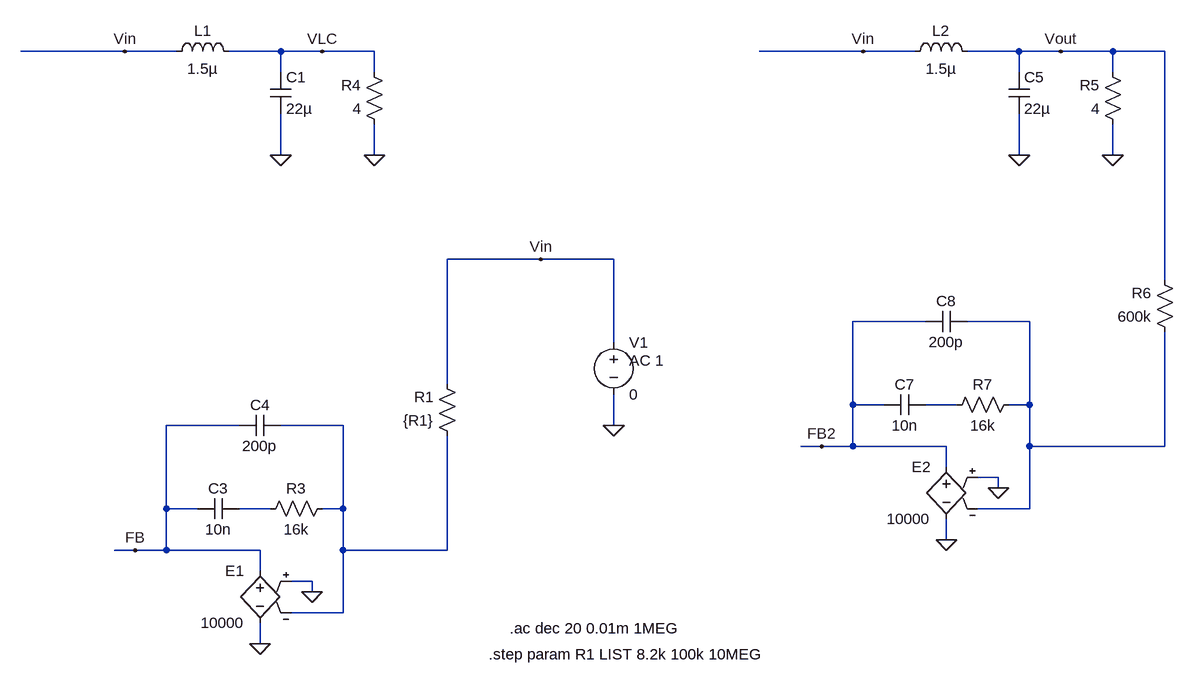
[diagram p0: schematic ErrorAmp2.asc]
ErrorAmp2.asc, the LTspice schematic file:
Version 4
SHEET 1 1920 680
WIRE -128 -512 -288 -512
WIRE -48 -512 -128 -512
WIRE 112 -512 32 -512
WIRE 176 -512 112 -512
WIRE 256 -512 176 -512
WIRE 1008 -512 848 -512
WIRE 1088 -512 1008 -512
WIRE 1248 -512 1168 -512
WIRE 1312 -512 1248 -512
WIRE 1392 -512 1312 -512
WIRE 1472 -512 1392 -512
WIRE 112 -480 112 -512
WIRE 256 -480 256 -512
WIRE 1248 -480 1248 -512
WIRE 1392 -480 1392 -512
WIRE 112 -352 112 -416
WIRE 256 -352 256 -400
WIRE 1248 -352 1248 -416
WIRE 1392 -352 1392 -400
WIRE 512 -192 368 -192
WIRE 624 -192 512 -192
WIRE 1472 -160 1472 -512
WIRE 1104 -96 992 -96
WIRE 1264 -96 1168 -96
WIRE 624 -64 624 -192
WIRE 368 0 368 -192
WIRE 992 32 992 -96
WIRE 1040 32 992 32
WIRE 1152 32 1104 32
WIRE 1264 32 1264 -96
WIRE 1264 32 1232 32
WIRE 48 64 -64 64
WIRE 208 64 112 64
WIRE 624 64 624 16
WIRE 944 96 912 96
WIRE 992 96 992 32
WIRE 992 96 944 96
WIRE 1136 96 992 96
WIRE 1264 96 1264 32
WIRE 1472 96 1472 -80
WIRE 1472 96 1264 96
WIRE 1136 128 1136 96
WIRE 1216 144 1184 144
WIRE 1216 160 1216 144
WIRE -64 192 -64 64
WIRE -16 192 -64 192
WIRE 96 192 48 192
WIRE 208 192 208 64
WIRE 208 192 176 192
WIRE 1264 192 1264 96
WIRE 1264 192 1184 192
WIRE 1136 240 1136 208
WIRE -112 256 -144 256
WIRE -64 256 -64 192
WIRE -64 256 -112 256
WIRE 80 256 -64 256
WIRE 208 256 208 192
WIRE 368 256 368 80
WIRE 368 256 208 256
WIRE 80 288 80 256
WIRE 160 304 128 304
WIRE 160 320 160 304
WIRE 208 352 208 256
WIRE 208 352 128 352
WIRE 80 400 80 368
FLAG 80 400 0
FLAG 160 320 0
FLAG 624 64 0
FLAG -112 256 FB
FLAG 112 -352 0
FLAG 256 -352 0
FLAG 512 -192 Vin
FLAG -128 -512 Vin
FLAG 176 -512 VLC
FLAG 1248 -352 0
FLAG 1392 -352 0
FLAG 1008 -512 Vin
FLAG 1312 -512 Vout
FLAG 1136 240 0
FLAG 1216 160 0
FLAG 944 96 FB2
SYMBOL voltage 624 -80 R0
WINDOW 123 24 44 Left 2
WINDOW 39 0 0 Left 2
SYMATTR InstName V1
SYMATTR Value 0
SYMATTR Value2 AC 1
SYMBOL e 80 272 M0
SYMATTR InstName E1
SYMATTR Value 10000
SYMBOL res 384 96 R180
WINDOW 0 36 76 Left 2
WINDOW 3 36 40 Left 2
SYMATTR InstName R1
SYMATTR Value {R1}
SYMBOL res 80 208 R270
WINDOW 0 32 56 VTop 2
WINDOW 3 0 56 VBottom 2
SYMATTR InstName R3
SYMATTR Value 16k
SYMBOL cap 48 176 R90
WINDOW 0 0 32 VBottom 2
WINDOW 3 32 32 VTop 2
SYMATTR InstName C3
SYMATTR Value 10n
SYMBOL cap 112 48 R90
WINDOW 0 0 32 VBottom 2
WINDOW 3 32 32 VTop 2
SYMATTR InstName C4
SYMATTR Value 200p
SYMBOL ind -64 -496 R270
WINDOW 0 32 56 VTop 2
WINDOW 3 5 56 VBottom 2
SYMATTR InstName L1
SYMATTR Value 1.5µ
SYMBOL cap 96 -480 R0
SYMATTR InstName C1
SYMATTR Value 22µ
SYMBOL res 272 -384 R180
WINDOW 0 36 76 Left 2
WINDOW 3 36 40 Left 2
SYMATTR InstName R4
SYMATTR Value 4
SYMBOL ind 1072 -496 R270
WINDOW 0 32 56 VTop 2
WINDOW 3 5 56 VBottom 2
SYMATTR InstName L2
SYMATTR Value 1.5µ
SYMBOL cap 1232 -480 R0
SYMATTR InstName C5
SYMATTR Value 22µ
SYMBOL res 1408 -384 R180
WINDOW 0 36 76 Left 2
WINDOW 3 36 40 Left 2
SYMATTR InstName R5
SYMATTR Value 4
SYMBOL e 1136 112 M0
SYMATTR InstName E2
SYMATTR Value 10000
SYMBOL res 1488 -64 R180
WINDOW 0 36 76 Left 2
WINDOW 3 36 40 Left 2
SYMATTR InstName R6
SYMATTR Value 600k
SYMBOL res 1136 48 R270
WINDOW 0 32 56 VTop 2
WINDOW 3 0 56 VBottom 2
SYMATTR InstName R7
SYMATTR Value 16k
SYMBOL cap 1104 16 R90
WINDOW 0 0 32 VBottom 2
WINDOW 3 32 32 VTop 2
SYMATTR InstName C7
SYMATTR Value 10n
SYMBOL cap 1168 -112 R90
WINDOW 0 0 32 VBottom 2
WINDOW 3 32 32 VTop 2
SYMATTR InstName C8
SYMATTR Value 200p
TEXT 464 376 Left 2 !.ac dec 20 0.01m 1MEG
TEXT 432 416 Left 2 !.step param R1 LIST 8.2k 100k 10MEG

The netlist it stands for:
* ErrorAmp2.asc
V1 Vin 0 0 AC 1
E1 FB 0 0 N003 10000
R1 N003 Vin {R1}
R3 N004 N003 16k
C3 N004 FB 10n
C4 N003 FB 200p
L1 Vin VLC 1.5µ
C1 VLC 0 22µ
R4 0 VLC 4
L2 Vin Vout 1.5µ
C5 Vout 0 22µ
R5 0 Vout 4
E2 FB2 0 0 N001 10000
R6 N001 Vout 600k
R7 N002 N001 16k
C7 N002 FB2 10n
C8 N001 FB2 200p
.ac dec 20 0.01m 1MEG
.step param R1 LIST 8.2k 100k 10MEG
.backanno
.end

* Results of the author's LTspice run, read from the files saved beside the schematic
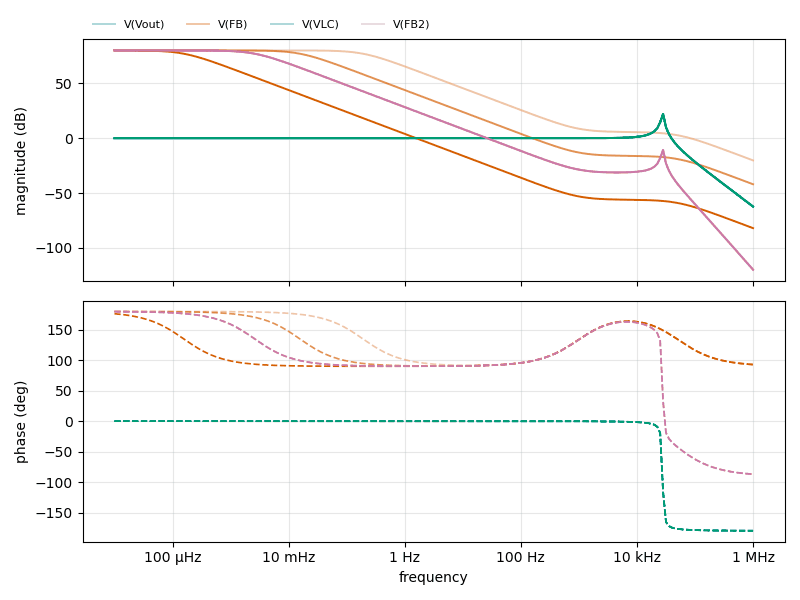
[diagram p1: AC Analysis of ErrorAmp2.asc, plotted from the saved traces]
* AC Analysis, 3 runs:
*   V(Vout) [r1=8200]: -0.00 dB at 10 µHz, -62.29 dB at 1 MHz, peak 22.12 dB at 28.18 kHz, 3 dB below the peak at 26.93 kHz and 29.01 kHz
*   V(Vout) [r1=100000]: -0.00 dB at 10 µHz, -62.29 dB at 1 MHz, peak 22.12 dB at 28.18 kHz, 3 dB below the peak at 26.93 kHz and 29.01 kHz
*   V(Vout) [r1=1e+007]: -0.00 dB at 10 µHz, -62.29 dB at 1 MHz, peak 22.12 dB at 28.18 kHz, 3 dB below the peak at 26.93 kHz and 29.01 kHz
*   V(FB) [r1=8200]: 80.00 dB at 10 µHz, -20.27 dB at 1 MHz, peak 80.00 dB at 10 µHz, 3 dB below the peak at 189.9 mHz
*   V(FB) [r1=100000]: 80.00 dB at 10 µHz, -42.00 dB at 1 MHz, peak 80.00 dB at 10 µHz, 3 dB below the peak at 15.59 mHz
*   V(FB) [r1=1e+007]: 79.98 dB at 10 µHz, -82.00 dB at 1 MHz, peak 79.98 dB at 10 µHz, 3 dB below the peak at 156.6 µHz
*   V(VLC) [r1=8200]: -0.00 dB at 10 µHz, -62.29 dB at 1 MHz, peak 22.12 dB at 28.18 kHz, 3 dB below the peak at 26.93 kHz and 29.01 kHz
*   V(VLC) [r1=100000]: -0.00 dB at 10 µHz, -62.29 dB at 1 MHz, peak 22.12 dB at 28.18 kHz, 3 dB below the peak at 26.93 kHz and 29.01 kHz
*   V(VLC) [r1=1e+007]: -0.00 dB at 10 µHz, -62.29 dB at 1 MHz, peak 22.12 dB at 28.18 kHz, 3 dB below the peak at 26.93 kHz and 29.01 kHz
*   V(FB2) [r1=8200]: 80.00 dB at 10 µHz, -119.85 dB at 1 MHz, peak 80.00 dB at 10 µHz, 3 dB below the peak at 2.597 mHz
*   V(FB2) [r1=100000]: 80.00 dB at 10 µHz, -119.85 dB at 1 MHz, peak 80.00 dB at 10 µHz, 3 dB below the peak at 2.597 mHz
*   V(FB2) [r1=1e+007]: 80.00 dB at 10 µHz, -119.85 dB at 1 MHz, peak 80.00 dB at 10 µHz, 3 dB below the peak at 2.597 mHz